# EAGLE design Main Board (EAGLE 8.6.3)
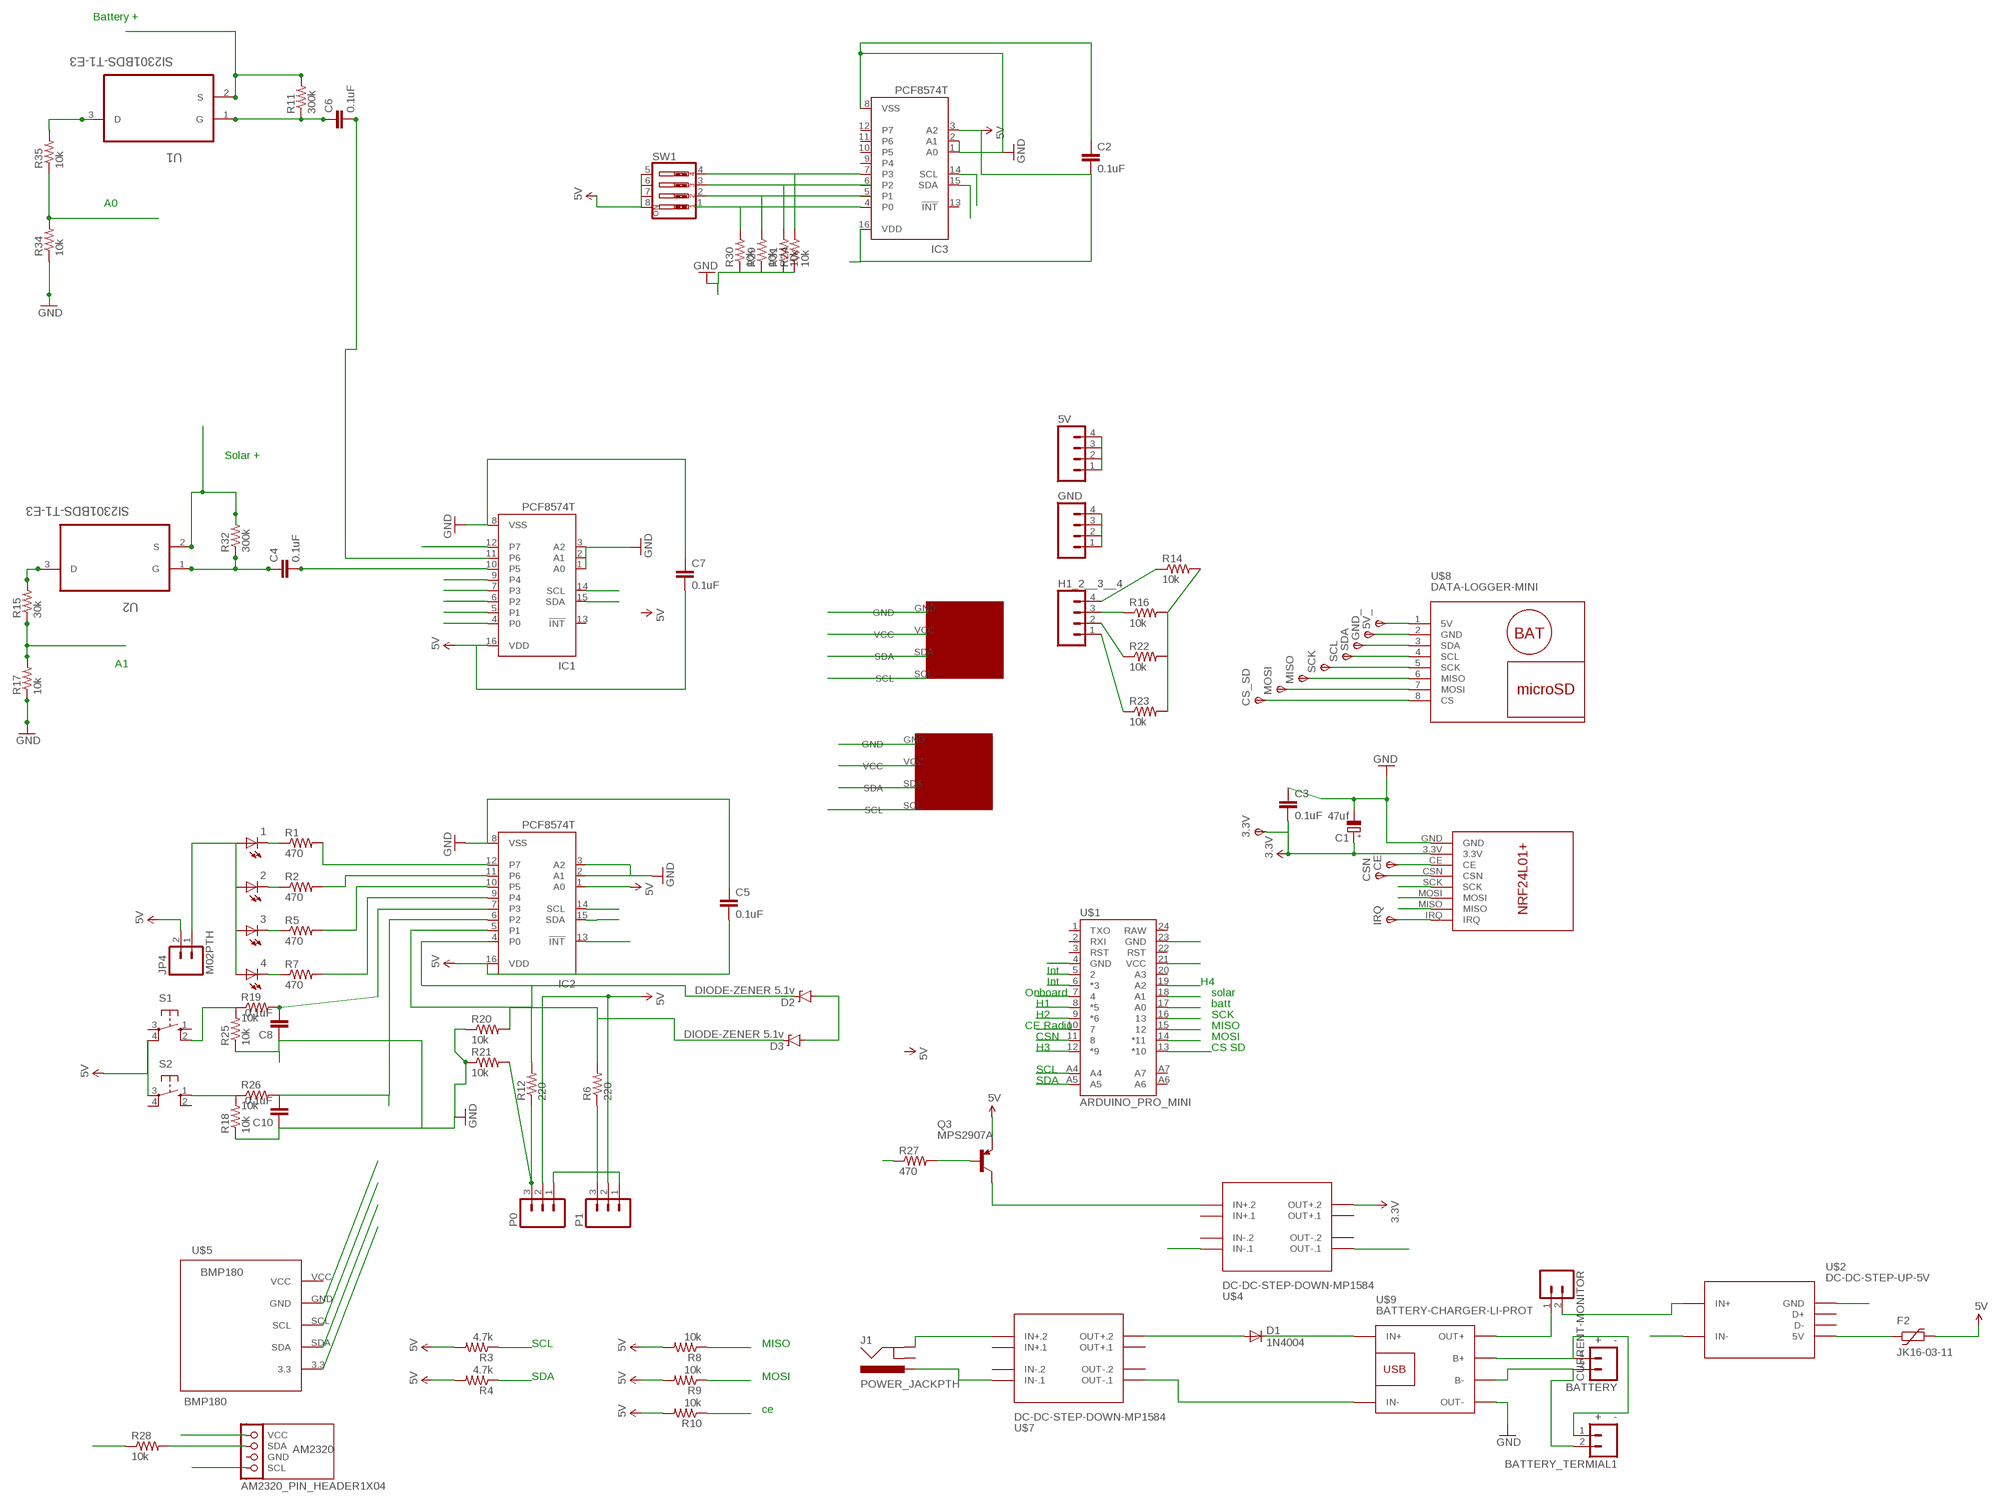
[diagram p0: schematic, sheet 1]

## Parts
1  LED3MM  [LED3MM]
2  LED3MM  [LED3MM]
3  LED3MM  [LED3MM]
3.3V  TPSB1,27  [B1,27]
4  LED3MM  [LED3MM]
5V  M04PTH  [1X04]
5V_  SCK  TPSB1,27  [B1,27]
AM2320  AM2320_PIN_HEADER1X04  [1X04]
BATTERY  + -  M02PTH  [1X02]
BATTERY_TERMIAL1  + -  M02PTH  [1X02]
C1  47uf  CPOL-EUE2.5-5  [E2,5-5]
C2  0.1uF  2.2UF-25V-+80/-20(0805)  [0805]
C3  0.1uF  2.2UF-25V-+80/-20(0805)  [0805]
C4  0.1uF  2.2UF-25V-+80/-20(0805)  [0805]
C5  0.1uF  2.2UF-25V-+80/-20(0805)  [0805]
C6  0.1uF  2.2UF-25V-+80/-20(0805)  [0805]
C7  0.1uF  2.2UF-25V-+80/-20(0805)  [0805]
C8  0.1uF  2.2UF-25V-+80/-20(0805)  [0805]
C10  0.1uF  2.2UF-25V-+80/-20(0805)  [0805]
CE  TPSB1,27  [B1,27]
CS_SD  TPSB1,27  [B1,27]
CSN  TPSB1,27  [B1,27]
CURRENT-MONITOR  M02PTH  [1X02]
D1  1N4004  [DO41-10]
D2  DIODE-ZENER 5.1v  DIODE-ZENERPTH  [DIODE-ZENER]
D3  DIODE-ZENER 5.1v  DIODE-ZENERPTH  [DIODE-ZENER]
F2  JK16-03-11  [JK16-03-11]
GND  M04PTH  [1X04]
GND_  GND  TPSB1,27  [B1,27]
H1_2__3__4  M04PTH  [1X04]
IC1  PCF8574T  [SO16W]
IC2  PCF8574T  [SO16W]
IC3  PCF8574T  [SO16W]
IRQ  TPSB1,27  [B1,27]
J1  POWER_JACKPTH  [POWER_JACK_PTH]
JP4  M02PTH  [1X02]
MISO  TPSB1,27  [B1,27]
MOSI  TPSB1,27  [B1,27]
P0  M03PTH  [1X03]
P1  M03PTH  [1X03]
Q3  MPS2907A  [TO92-CBE]
R1  470  RESISTOR1206  [1206]
R2  470  RESISTOR1206  [1206]
R3  4.7k  RESISTOR1206  [1206]
R4  4.7k  RESISTOR1206  [1206]
R5  470  RESISTOR1206  [1206]
R6  220  RESISTOR1206  [1206]
R7  470  RESISTOR1206  [1206]
R8  10k  RESISTOR1206  [1206]
R9  10k  RESISTOR1206  [1206]
R10  10k  RESISTOR1206  [1206]
R11  300k  RESISTORPTH-1/6W  [1/6W-RES]
R12  220  RESISTOR1206  [1206]
R14  10k  RESISTOR1206  [1206]
R15  30k  RESISTORPTH-1/6W  [1/6W-RES]
R16  10k  RESISTOR1206  [1206]
R17  10k  RESISTORPTH-1/6W  [1/6W-RES]
R18  10k  RESISTOR1206  [1206]
R19  10k  RESISTOR1206  [1206]
R20  10k  RESISTOR1206  [1206]
R21  10k  RESISTOR1206  [1206]
R22  10k  RESISTOR1206  [1206]
R23  10k  RESISTOR1206  [1206]
R24  10k  RESISTOR1206  [1206]
R25  10k  RESISTOR1206  [1206]
R26  10k  RESISTOR1206  [1206]
R27  470  RESISTOR1206  [1206]
R28  10k  RESISTOR1206  [1206]
R29  10k  RESISTOR1206  [1206]
R30  10k  RESISTOR1206  [1206]
R31  10k  RESISTOR1206  [1206]
R32  300k  RESISTORPTH-1/6W  [1/6W-RES]
R34  10k  RESISTORPTH-1/6W  [1/6W-RES]
R35  10k  RESISTORPTH-1/6W  [1/6W-RES]
S1  10-XX  [B3F-10XX]
S2  10-XX  [B3F-10XX]
SCK  SCK  TPSB1,27  [B1,27]
SCL  SCK  TPSB1,27  [B1,27]
SDA  SCK  TPSB1,27  [B1,27]
SW1  SW_DIP-4  [EDG-04]
U1  SI2301BDS-T1-E3  [SOT95P237X112-3N]
U2  SI2301BDS-T1-E3  [SOT95P237X112-3N]
U$1  ARDUINO_PRO_MINI  [ARDUINO_PRO_MINI]
U$2  DC-DC-STEP-UP-5V  [DC-DC-STEP-UP-5V]
U$3  NRF24L01  [NRF24L01]
U$4  DC-DC-STEP-DOWN-MP1584  [DC-DC-STEP-DOWN-MP1584]
U$5  BMP180  BMP180BMP180  [1X05]
U$7  DC-DC-STEP-DOWN-MP1584  [DC-DC-STEP-DOWN-MP1584]
U$8  DATA-LOGGER-MINI  [DATA-LOGGER-MINI]
U$9  BATTERY-CHARGER-LI-PROT  [BATTERY-CHARGER-LI-PROT]
U$10  TJC8-4P  [TJC8-4P]
U$11  TJC8-4P  [TJC8-4P]

## Nets
3.3V: 3.3V.TP(PP) C1.+ C3.2 U$3.3.3V U$4.OUT+.2 U$5.3.3
5V: 5V.1 5V.2 5V.3 5V.4 5V_.TP(PP) AM2320.1(VCC) C2.2 C5.2 C7.2 F2.P$2 IC1.16(VDD) IC2.1(A0) IC2.16(VDD) IC3.3(A2) IC3.16(VDD) JP4.2 P0.2 P1.2 Q3.E R3.2 R4.2 R8.2 R9.2 R10.2 R14.2 R16.2 R22.2 R23.2 R28.1 S1.4(P1) S2.3(P) SW1.5 SW1.6 SW1.7 SW1.8 U$1.21(VCC) U$8.1(5V) U$10.VCC U$11.VCC
12B: IC1.12(P7) R27.1
12B2: Q3.B R27.2
A0: R34.2 R35.1 U$1.17(A0)
A1: R15.1 R17.2 U$1.18(A1)
B+: BATTERY.1 BATTERY_TERMIAL1.1 R11.2 U1.2(S) U$9.B+
CE_RADIO: CE.TP(PP) R10.1 U$1.10 U$3.CE
CS-SD: CS_SD.TP(PP) U$1.13(*10) U$8.8(CS)
CSN: U$1.11
GND: AM2320.4(SCL) C1.- C2.1 C3.1 C5.1 C7.1 C8.1 C10.1 D2.P$2(A) D3.P$2(A) GND.1 GND.2 GND.3 GND.4 GND_.TP(PP) IC1.1(A0) IC1.2(A1) IC1.3(A2) IC1.8(VSS) IC2.2(A1) IC2.3(A2) IC2.8(VSS) IC3.1(A0) IC3.2(A1) IC3.8(VSS) P0.1 P1.1 R17.1 R18.1 R20.1 R21.1 R24.1 R25.1 R29.1 R30.1 R31.1 R34.1 U$1.4(GND) U$1.23(GND) U$2.GND U$2.IN- U$3.GND U$4.IN-.1 U$4.OUT-.1 U$5.GND U$8.2(GND) U$9.OUT- U$10.GND U$11.GND
H1: H1_2__3__4.1 IC1.5(P1) R23.1 U$1.8(*5)
H2: H1_2__3__4.2 IC1.6(P2) R22.1 U$1.9(*6)
H3: H1_2__3__4.3 IC1.7(P3) R16.1 U$1.12(*9)
H4: H1_2__3__4.4 IC1.9(P4) R14.1 U$1.19(A2)
INT8574: IC2.13(!INT) U$1.6(*3)
IRQ: IRQ.TP(PP) U$1.5 U$3.IRQ
MISO: MISO.TP(PP) R8.1 U$1.15 U$3.MISO U$8.6(MISO)
MOSI: MOSI.TP(PP) R9.1 U$1.14(*11) U$3.MOSI U$8.7(MOSI)
N$1: BATTERY.2 BATTERY_TERMIAL1.2 U$9.B-
N$2: C6.2 IC1.11(P6)
N$3: 4.K(C) R7.1
N$4: 3.K(C) R5.1
N$5: 2.K(C) R2.1
N$6: 1.K(C) R1.1
N$7: IC2.12(P7) R1.2
N$8: 1.A 2.A 3.A 4.A JP4.1
N$9: IC2.11(P6) R2.2
N$10: IC2.10(P5) R5.2
N$11: IC2.9(P4) R7.2
N$12: CURRENT-MONITOR.1 U$9.OUT+
N$13: D2.P$1(C) IC2.4(P0) IC2.5(P1) R12.2
N$14: U$7.OUT-.1 U$9.IN-
N$15: D1.C U$9.IN+
N$16: D1.A U$7.OUT+.2
N$17: F2.P$1 U$2.5V
N$18: CURRENT-MONITOR.2 U$2.IN+
N$19: J1.PWR U$7.IN-.1
N$20: C8.2 IC2.7(P3) R19.2
N$21: C4.2 IC1.10(P5)
N$22: P0.3 R12.1 R21.2
N$23: C10.2 IC2.6(P2) R26.2
N$24: P1.3 R6.1
N$25: C4.1 R32.1 U2.1(G)
N$26: IC3.4(P0) R30.2
N$27: D3.P$1(C) R6.2 R20.2
N$28: R15.2 U2.3(D)
N$29: C6.1 R11.1 U1.1(G)
N$30: R19.1 R25.2 S1.2(S1)
N$31: Q3.C U$4.IN+.2
N$32: R29.2 SW1.2
N$33: R31.2 SW1.3
N$34: IC3.7(P3) R24.2 SW1.4
N$35: R35.2 U1.3(D)
N$36: CSN.TP(PP) U$3.CSN
N$37: R18.2 R26.1 S2.1(S)
ONBOARD: AM2320.2(SDA) IC1.4(P0) R28.2 U$1.7
S+: J1.GND R32.2 U2.2(S) U$7.IN+.2
SCK: SCK.TP(PP) U$1.16 U$3.SCK U$8.5(SCK)
SCL: IC1.14(SCL) IC2.14(SCL) IC3.14(SCL) R3.1 SCL.TP(PP) U$1.A5 U$5.SCL U$8.4(SCL) U$10.SCL U$11.SCL
SDA: IC1.15(SDA) IC2.15(SDA) IC3.15(SDA) R4.1 SDA.TP(PP) U$1.A4 U$5.SDA U$8.3(SDA) U$10.SDA U$11.SDA
Unconnected: AM2320.3(GND) IC1.13(!INT) IC3.5(P1) IC3.6(P2) IC3.9(P4) IC3.10(P5) IC3.11(P6) IC3.12(P7) IC3.13(!INT) J1.GNDBREAK S1.1(S) S1.3(P) S2.2(S1) S2.4(P1) SW1.1 U$1.1(TXO) U$1.2(RXI) U$1.3(RST) U$1.20(A3) U$1.22(RST) U$1.24(RAW) U$1.A6 U$1.A7 U$2.D+ U$2.D- U$4.IN+.1 U$4.IN-.2 U$4.OUT+.1 U$4.OUT-.2 U$5.VCC U$7.IN+.1 U$7.IN-.2 U$7.OUT+.1 U$7.OUT-.2

## Notes on the sheet
- Battery +
- A0
- Solar +
- A1
- Int
- Int | H4
- Onboard | solar
- H1 | batt
- H2 | SCK
- CE Radio | MISO
- CSN | MOSI
- H3 | CS SD
- SCL
- SDA
- SCL | MISO
- SDA | MOSI
- ce

## Library data of the parts
1-4 = adafruit:LED: LED OSRAM: - CHIPLED LG R971, LG N971, LY N971, LG Q971, LY Q971, LO R971, LY R971 LH N974, LH R974 LS Q976, LO Q976, LY Q976 LO Q996 - Hyper CHIPLED LW Q18S LB Q993, LB Q99A, LB R99A - SideLED LS A670, LO A670, LY A670, LG A670, LP A670 LB A673, LV A673, LT A673, LW A673 LH A674 LY A675 LS A676, LA A676, LO A676, LY A676, LW A676 LS A679, LY A679, LG A679 - Hyper Micro SIDELED® LS Y876, LA Y876, LO Y876, LY Y876 LT Y87S - SmartLED LW L88C, LW L88S LB L89C, LB L89S, LG L890 LS L89K, LO L89K, LY L89K LS L896, LA L896, LO L896, LY L896 - TOPLED LS T670, LO T670, LY T670, LG T670, LP T670 LSG T670, LSP T670, LSY T670, LOP T670, LYG T670 LG T671, LOG T671, LSG T671 LB T673, LV T673, LT T673, LW T673 LH T674 LS T676, LA T676, LO T676, LY T676, LB T676, LH T676, LSB T676, LW T676 LB T67C, LV T67C, LT T67C, LS T67K, LO T67K, LY T67K, LW E67C LS E67B, LA E67B, LO E67B, LY E67B, LB E67C, LV E67C, LT E67C LW T67C LS T679, LY T679, LG T679 LS T770, LO T770, LY T770, LG T770, LP T770 LB T773, LV T773, LT T773, LW T773 LH T774 LS E675, LA E675, LY E675, LS T675 LS T776, LA T776, LO T776, LY T776, LB T776 LHGB T686 LT T68C, LB T68C - Hyper Mini TOPLED® LB M676 - Mini TOPLED Santana® LG M470 LS M47K, LO M47K, LY M47K Source: http://www.osram.convergy.de/
3.3V 5V_ CE CS_SD CSN GND_ IRQ MISO MOSI SCK SCL SDA = testpad:TPS: TEST PIN
5V GND H1_2__3__4 = SparkFun-Connectors:M04: Header 4 Standard 4-pin 0.1" header. Use with straight break away headers (SKU : PRT-00116), right angle break away headers (PRT-00553), swiss pins (PRT-00743), machine pins (PRT-00117), and female headers (PRT-00115). Molex polarized connector foot print use with SKU : PRT-08231 with associated crimp pins and housings. 1MM SMD Version SKU: PRT-10208
AM2320 = diy-drohne200-2:AM2320_PIN_HEADER: AM2320B Connector AM2320 pin assignment i2C or 1-Wir Pin Name Description 1 VDD Power supply(3.1-5.5V) 2 SDA Serial data, bidirectional port (1 Wire - connect SCL GND) 3 GND Ground 4 SCL Serial clock input port (single bus ground) Description <https://akizukidenshi.com/download/ds/aosong/AM2320.pdf>
BATTERY BATTERY_TERMIAL1 CURRENT-MONITOR JP4 = SparkFun-Connectors:M02: Standard 2-pin 0.1" header. Use with - straight break away headers ( PRT-00116) - right angle break away headers (PRT-00553) - swiss pins (PRT-00743) - machine pins (PRT-00117) - female headers (PRT-00115) Molex polarized connector foot print use with: PRT-08233 with associated crimp pins and housings. 2.54_SCREWTERM for use with PRT-10571. 3.5mm Screw Terminal footprints for PRT-08084 5mm Screw Terminal footprints for use with PRT-08432
C1 = rcl:CPOL-EU: POLARIZED CAPACITOR, European symbol
C2-C8 C10 = SparkFun-Capacitors:2.2UF-25V-+80/-20(0805): CAP-11624; PROD_ID: CAP-11624; VALUE: 2.2uF
D1 = adafruit:1N4004: DIODE General purpose 1N400x type rectifier (With bigger pads) http://www.ladyada.net/library/pcb/eaglelibrary.html
D2 D3 = SparkFun-DiscreteSemi:DIODE-ZENER: Zener Diode Production Part - 8199 3.4V Zener Voltage
F2 = ptc-littlefuse:JK16-03-11
IC1-IC3 = micro-philips:PCF8574: I2C-Bus Remote 8-bit I/O expander http://www.semiconductors.philips.com/acrobat_download/datasheets/PCF8574_4.pdf; MPN: PCF8574T/3,512; OC_FARNELL: 1201255; OC_NEWARK: 70R6870
J1 = SparkFun-Connectors:POWER_JACK: Power Jack This is the standard 5.5mm barrel jack for power. The PTH is the most common, proven, reliable, footprint. The Slot footprint only works if the mill layer is transmitted to the PCB fab house so be warned. Mating wall wart : TOL-00298 (and others); PROD_ID: PRT-00119
P0 P1 = SparkFun-Connectors:M03: Header 3 Standard 3-pin 0.1" header. Use with straight break away headers (SKU : PRT-00116), right angle break away headers (PRT-00553), swiss pins (PRT-00743), machine pins (PRT-00117), and female headers (PRT-00115). Molex polarized connector foot print use with SKU : PRT-08232 with associated crimp pins and housings.
Q3 = transistor-pnp:MPS2907*: PNP Transistror
R1-R10 R12 R14 R16 R18 R19 R22-R31 = SparkFun-Passives:RESISTOR: Resistor Basic schematic elements and footprints for 0603, 1206, and PTH resistors.
R11 R15 R17 R20 R21 R32 R34 R35 = SparkFun-Resistors:RESISTOR: Resistor Basic schematic elements and footprints for 0603, 1206, and PTH resistors.
S1 S2 = switch-omron:10-XX: OMRON SWITCH
SW1 = special:SW_DIP-4: DIP SWITCH
U1 U2 = Vishay_By_element14_Batch_1:SI2301BDS-T1-E3: MOSFET; MPN: SI2301BDS-T1-E3; OC_FARNELL: 1470099; OC_NEWARK: 06J7561; PACKAGE: SOT-23-3; SUPPLIER: VISHAY
U$1 = SparkFun-Boards:ARDUINO_PRO_MINI
U$2 = diy-modules:DC-DC-STEP-UP-5V: DC/DC Step-Up Converter
U$3 = eBay parts:NRF24L01: NRF24L01+ module from eBay NOTE: Untested layout
U$4 U$7 = diy-modules:DC-DC-STEP-DOWN-MP1584: DC/DC Step-Down Regulator based on MP1584 chip MP1584 datasheet available here: http://www.haoyuelectronics.com/Attachment/MP1584/MP1584.pdf Click here to find device on ebay.com <http://www.ebay.com/sch/mp1584+module>
U$5 = chris_Library:BMP180
U$8 = diy-modules:DATA-LOGGER-MINI: Mini Data Logger with microSD card and battery powered RTC based on DS1307 chip Arduino library for DS1307 and description are available here: https://www.pjrc.com/teensy/td_libs_DS1307RTC.html Tutorial how to use SD card with Arduino: https://www.arduino.cc/en/reference/SD Click here to find device on ebay.com <http://www.ebay.com/sch/mini+data+logger+arduino>
U$9 = diy-modules:BATTERY-CHARGER-LI-PROT: Lithium Battery 5V Charger with protection circuit More details available here: http://www.instructables.com/id/DIY-Lithium-ion-Battery-Charger/step4/TP4056-based-lithium-ion-battery-charger-module/ Click here to find device on ebay.com <http://www.ebay.com/sch/tp4056+charger+usb+protection>
U$10 U$11 = chris_Library:TJC8-4P

## Board
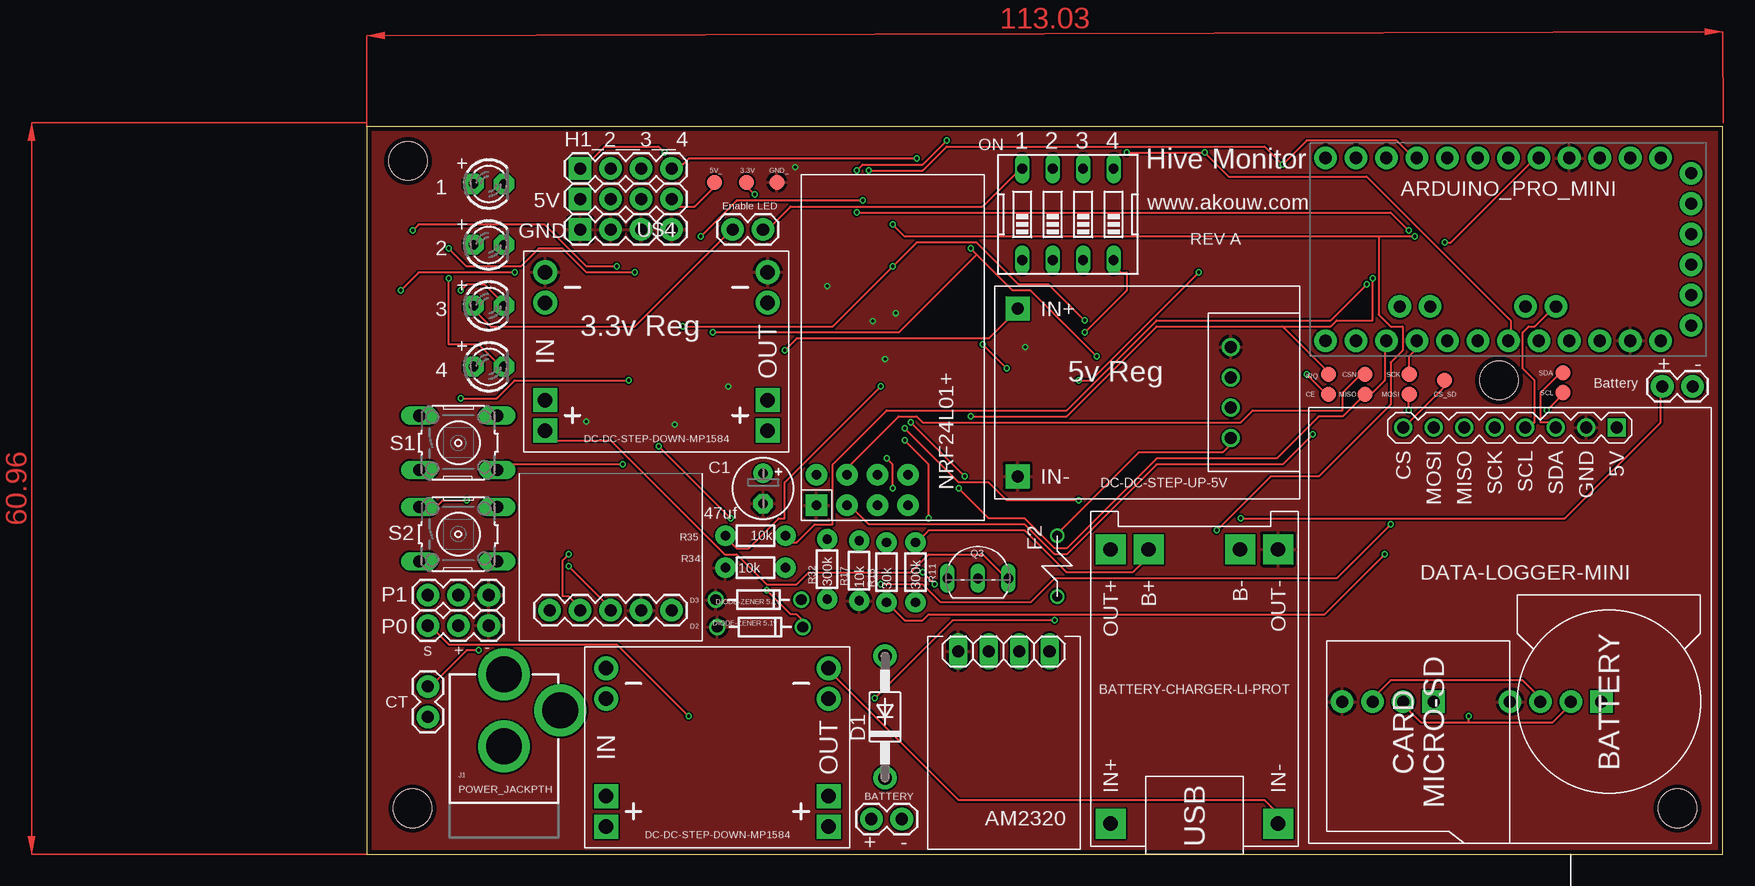
[diagram p1: board, top side]
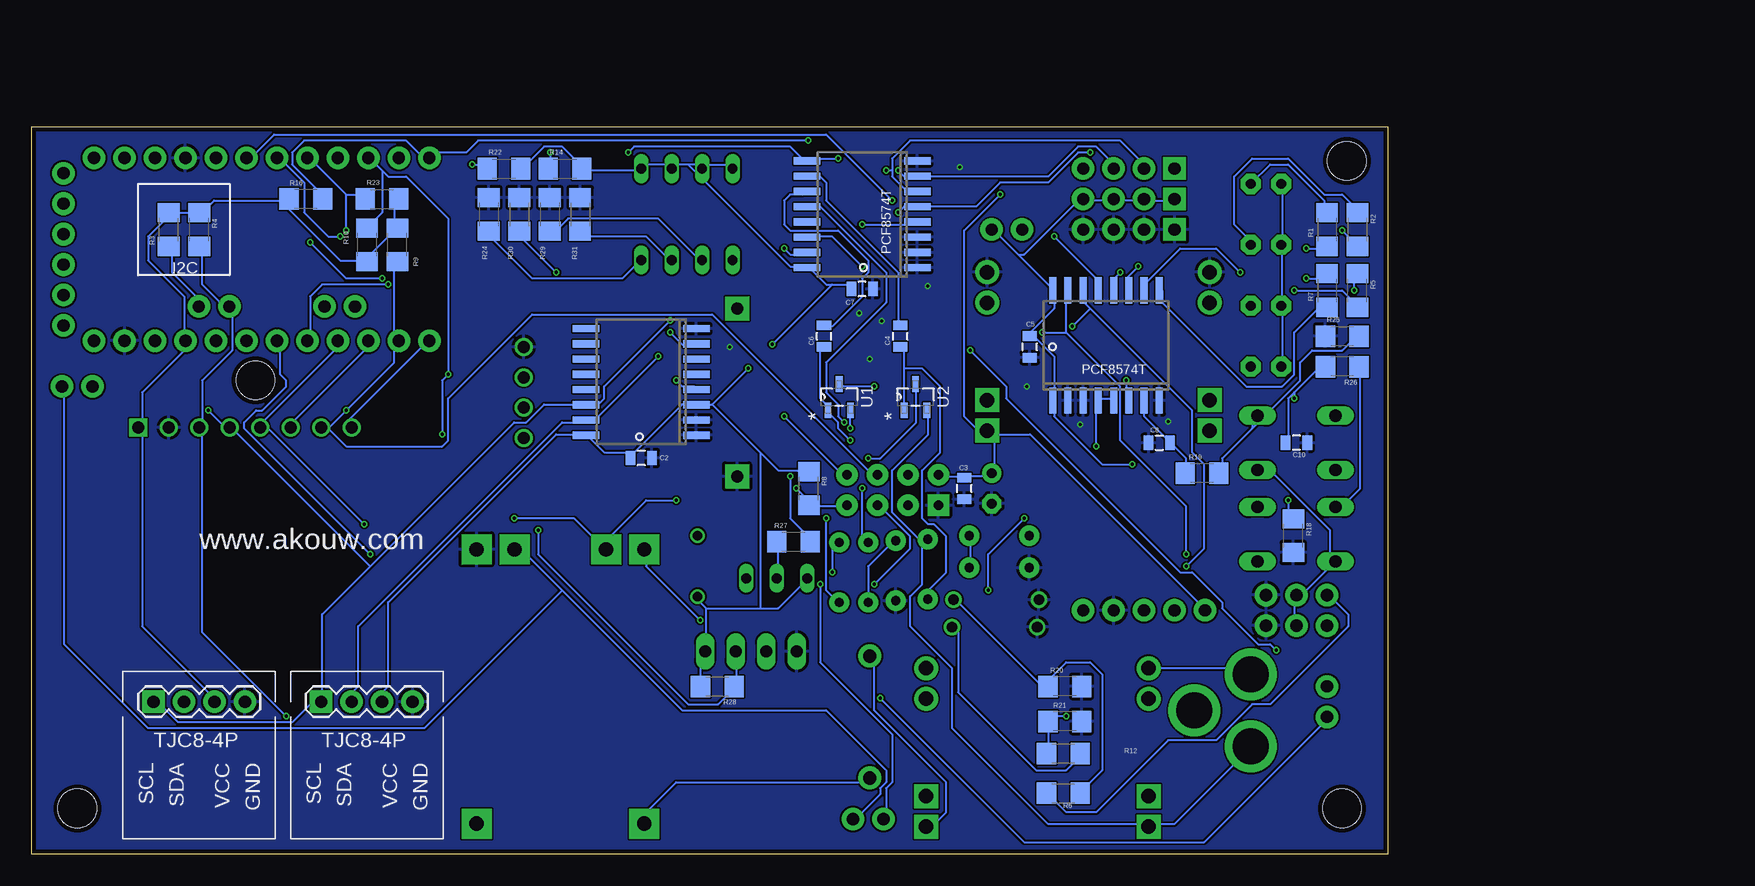
[diagram p2: board, bottom side, seen from below]

Size 113.01 x 60.63 mm. Coordinates in mm from the lower left corner, seen from the top.
Outline: 0,0 113.01,0 113.01,60.63 0,60.63 0,0
Copper layers (1*16): Top 0.035559375mm / dielectric 1.6mm / Bottom 0.035559375mm
Design rules "oshpark-2layer": minimum track width 6mil, minimum drill 10mil, track to track 6mil, track to pad 6mil, pad to pad 6mil, via to via 6mil, smd to smd 6mil, copper to edge 15mil, drill to drill 6mil, minimum pad ring 5mil, minimum via ring 5mil, stop-mask expansion 2.5mil, vias tented up to drill 0mil, thermal gap 10mil
Holes 3.2 mm at 3.81,3.81 109.22,3.81 3.43,57.78 94.36,39.5

### Footprints (pad centres in the part's own frame; a part is rotated, then mirrored left to right if it is on the bottom)
LED3MM = drill 0.813 pad 1.676 octagon: A -1.27,0; K 1.27,0
B1,27 = smd 1.27 x 1.27: TP 0,0
1X04 = drill 1.016 pad 1.88 square: 1 0,0 | drill 1.016 pad 1.88: 2 2.54,0; 3 5.08,0; 4 7.62,0
1X04' = drill 1.016 long: 1 -3.81,0; 2 -1.27,0; 3 1.27,0; 4 3.81,0
1X02 = drill 1.016 pad 1.88: 1 0,0; 2 2.54,0
E2,5-5 = drill 0.813 pad 1.6: + -1.27,0 | drill 0.813 pad 1.6 octagon: - 1.27,0
0805 = smd 0.8 x 1.2: 1 -0.9,0; 2 0.9,0
DO41-10 = drill 1.118 pad 1.93: A 5.08,0; C -5.08,0
DIODE-ZENER = drill 0.9: P$1 -3.556,0; P$2 3.556,0
JK16-03-11 = drill 0.8: P$1 -2.54,0; P$2 2.54,0
SO16W = smd 0.6 x 2.2: 1 -4.445,-4.6; 2 -3.175,-4.6; 3 -1.905,-4.6; 4 -0.635,-4.6; 5 0.635,-4.6; 6 1.905,-4.6; 7 3.175,-4.6; 8 4.445,-4.6; 9 4.445,4.6; 10 3.175,4.6; 11 1.905,4.6; 12 0.635,4.6; 13 -0.635,4.6; 14 -1.905,4.6; 15 -3.175,4.6; 16 -4.445,4.6
POWER_JACK_PTH = drill 2.997 pad 4.318: GND 0,7.7; GNDBREAK 4.7,10.7; PWR 0,13.7
1X03 = drill 1.016 pad 1.88: 1 0,0; 2 2.54,0; 3 5.08,0
TO92-CBE = drill 0.813 long: B 0,0; C 2.54,0; E -2.54,0
1206 = smd 1.6 x 1.8: 1 -1.4,0; 2 1.4,0
1/6W-RES = drill 0.762 pad 1.676: 1 -2.5,0; 2 2.5,0
B3F-10XX = drill 1.016 long: 1 -3.251,2.261; 2 3.251,2.261; 3 -3.251,-2.261; 4 3.251,-2.261
EDG-04 = drill 0.813 long: 1 -3.81,-3.81; 2 -1.27,-3.81; 3 1.27,-3.81; 4 3.81,-3.81; 5 3.81,3.81; 6 1.27,3.81; 7 -1.27,3.81; 8 -3.81,3.81
SOT95P237X112-3N = smd 1.321 x 0.559: 1 -1.092,0.94; 2 -1.092,-0.94; 3 1.092,0
ARDUINO_PRO_MINI = drill 1.016 pad 1.88: 1 -7.62,12.7; 2 -7.62,10.16; 3 -7.62,7.62; 4 -7.62,5.08; 5 -7.62,2.54; 6 -7.62,0; 7 -7.62,-2.54; 8 -7.62,-5.08; 9 -7.62,-7.62; 10 -7.62,-10.16; 11 -7.62,-12.7; 12 -7.62,-15.24; 13 7.62,-15.24; 14 7.62,-12.7; 15 7.62,-10.16; 16 7.62,-7.62; 17 7.62,-5.08; 18 7.62,-2.54; 19 7.62,0; 20 7.62,2.54; 21 7.62,5.08; 22 7.62,7.62; 23 7.62,10.16; 24 7.62,12.7; A4 4.763,1.429; A5 4.763,3.969; A6 4.763,-9.049; A7 4.763,-6.509; BLK -6.35,15.24; GND -3.81,15.24; GRN 6.35,15.24; RXI 1.27,15.24; TXO 3.81,15.24; VCC -1.27,15.24
DC-DC-STEP-UP-5V = drill 1: 5V 6.985,-3.81; D+ 6.985,1.27; D- 6.985,-1.27; GND 6.985,3.81 | drill 1 pad 2 square: IN+ -10.795,6.985; IN- -10.795,-6.985
NRF24L01 = drill 0.8 pad 1.778: 3.3V 0,2.54; CE 2.54,0; CSN 2.54,2.54; IRQ 7.62,2.54; MISO 7.62,0; MOSI 5.08,2.54; SCK 5.08,0 | drill 0.8 pad 1.778 square: GND 0,0
DC-DC-STEP-DOWN-MP1584 = drill 1.2 pad 2 square: IN+.1 -9.271,-4.064; IN+.2 -9.271,-6.604; OUT+.1 9.271,-4.064; OUT+.2 9.271,-6.604 | drill 1.2 pad 2: IN-.1 -9.271,6.604; IN-.2 -9.271,4.064; OUT-.1 9.271,6.604; OUT-.2 9.271,4.064
1X05 = drill 1.016 pad 1.88: 3.3 10.16,0; GND 2.54,0; SCL 5.08,0; SDA 7.62,0; VCC 0,0
DATA-LOGGER-MINI = drill 1 square: 1 -16.51,8.89 | drill 1: 2 -16.51,6.35; 3 -16.51,3.81; 4 -16.51,1.27; 5 -16.51,-1.27; 6 -16.51,-3.81; 7 -16.51,-6.35; 8 -16.51,-8.89
BATTERY-CHARGER-LI-PROT = drill 1.2 pad 2.5 square: B+ 10.795,3.81; B- 10.795,-3.81; IN+ -12.065,6.985; IN- -12.065,-6.985; OUT+ 10.795,6.985; OUT- 10.795,-6.985
TJC8-4P = drill 1.016 pad 1.88: GND 7.62,0; SDA 2.54,0; VCC 5.08,0 | drill 1.016 pad 1.88 square: SCL 0,0

### Placement (x,y rotation side)
1  10.16,55.88 0 top
2  10.16,50.8 0 top
3  10.16,45.72 0 top
3.3V  31.62,56.01 0 top
4  10.16,40.64 0 top
5V  17.78,54.61 0 top
5V_  28.96,56.01 0 top
AM2320  AM2320_PIN_HEADER1X04  [1X04']  53.09,16.89 180 top
BATTERY  42.04,2.92 0 top
BATTERY_TERMIAL1  107.95,38.99 0 top
C1  33.02,30.48 270 top
C2  62.23,33.02 180 bottom
C3  35.31,30.48 90 bottom
C4  40.64,43.18 90 bottom
C5  29.84,42.29 90 bottom
C6  46.99,43.18 90 bottom
C7  43.82,47.12 180 bottom
C8  19.05,34.29 0 bottom
C10  7.62,34.29 180 bottom
CE  80.14,38.35 0 top
CS_SD  89.79,39.5 0 top
CSN  83.19,40.01 0 top
CURRENT-MONITOR  5.08,11.43 90 top
D1  43.18,11.43 90 top
D2  32.77,18.92 180 top
D3  32.64,21.21 180 top
F2  57.53,24 270 top
GND  17.78,52.07 0 top
GND_  34.16,56.01 0 top
H1_2__3__4  17.78,57.15 0 top
IC1  43.82,53.34 90 bottom
IC2  23.49,42.42 0 bottom
IC3  62.23,39.37 90 bottom
IRQ  80.14,40.01 0 top
J1  11.43,1.27 0 top
JP4  30.48,52.07 0 top
MISO  83.19,38.35 0 top
MOSI  86.87,38.35 0 top
P0  10.16,19.05 180 top
P1  10.16,21.59 180 top
Q3  50.93,22.99 0 top
R1  5.08,52.07 270 bottom
R2  2.54,52.07 270 bottom
R3  101.6,52.07 90 bottom
R4  99.06,52.07 90 bottom
R5  2.54,46.99 90 bottom
R6  27.05,5.08 0 bottom
R7  5.08,46.99 270 bottom
R8  48.26,30.48 90 bottom
R9  82.55,50.8 90 bottom
R10  85.09,50.8 270 bottom
R11  45.72,23.5 90 top
R12  27.05,8.38 0 bottom
R14  68.58,57.15 0 bottom
R15  43.31,23.5 90 top
R16  90.17,54.61 180 bottom
R17  41.02,23.62 90 top
R18  7.87,26.54 90 bottom
R19  15.49,31.75 180 bottom
R20  26.92,13.97 180 bottom
R21  26.92,11.05 180 bottom
R22  73.66,57.15 0 bottom
R23  83.82,54.61 0 bottom
R24  74.93,53.34 270 bottom
R25  3.81,43.18 0 bottom
R26  3.81,40.64 180 bottom
R27  49.53,26.04 180 bottom
R28  55.88,13.97 0 bottom
R29  69.85,53.34 270 bottom
R30  72.39,53.34 270 bottom
R31  67.31,53.34 270 bottom
R32  38.35,23.75 90 top
R34  32.38,23.88 0 top
R35  32.38,26.54 180 top
S1  7.62,34.29 0 top
S2  7.62,26.67 0 top
SCK  86.87,40.01 0 top
SCL  99.7,38.48 0 top
SDA  99.7,40.13 0 top
SW1  58.42,53.34 0 top
U1  45.72,38.1 90 bottom
U2  39.37,38.1 90 bottom
U$1  95.12,50.42 270 top
U$2  65.02,38.48 0 top
U$3  37.47,29.08 0 top
U$4  24.13,41.91 0 top
U$5  25.4,20.32 180 top
U$7  29.21,8.89 0 top
U$8  95.25,19.05 270 top
U$9  68.96,14.61 90 top
U$10  88.9,12.7 0 bottom
U$11  102.87,12.7 0 bottom

### Tracks (layer width: path | path; a pad name or v marks a point on that pad's centre or on a via)
3.3V  (via drill 0.25)
  Top 0.152: v32.31,55 31.81,55.5 31.81,56 3.3V.TP
  Bottom 0.152: U$3.3.3V 37.31,31.5 35.31,31.5 C3.2 34.81,31.5 33.31,31.5 C1.+ 32.81,32 32.81,35 | v32.31,55 35.31,52 35.31,36.5 33.81,35 U$4.OUT+.2 | 32.81,35 33.31,35 U$4.OUT+.2 | 32.81,35 29.81,35 15.31,20.5 U$5.3.3 | 32.81,35 U$4.OUT+.2
5V  (via drill 0.25)
  Top 0.152: U$10.VCC 84.31,13 84.31,13.5 85.31,14.5 96.31,14.5 97.81,13 U$11.VCC | 5V_.TP 28.81,56 28.81,55.5 27.31,54 25.81,54 25.31,54.5 5V.4 | v21.31,32.5 11.31,32.5 S1.4 | SW1.8 54.31,57 51.31,54 35.31,54 33.81,52.5 33.31,52.5 JP4.2 | v51.31,42.5 v53.31,40.5
  Bottom 0.152: R28.1 57.31,14 57.31,16.5 AM2320.1 56.81,17 56.81,20.5 | 56.81,20.5 57.31,21 F2.P$2 | 56.81,20.5 52.31,20.5 | 52.31,20.5 50.81,20.5 48.81,22.5 Q3.E | 56.31,37.5 52.31,33.5 | 52.31,33.5 50.81,32 48.31,32 R8.2 | 56.31,37.5 57.31,37.5 IC3.3 57.81,37.5 58.81,37.5 62.81,33.5 C2.2 63.31,33.5 65.31,33.5 66.81,35 IC3.16 67.31,35 69.31,35 83.31,21 83.31,14 84.31,13 U$10.VCC | 52.31,33.5 52.31,20.5 | R23.2 82.81,54.5 82.81,52.5 R9.2 82.81,52 84.81,50 84.81,49.5 R10.2 85.31,49.5 87.31,49.5 92.31,54.5 | 92.31,54.5 97.81,54.5 98.81,53.5 R4.2 99.31,53.5 101.31,53.5 R3.2 101.81,53 103.31,51.5 103.31,49.5 100.31,46.5 100.31,43 U$1.21 99.81,42.5 103.81,38.5 103.81,36 U$8.1 103.81,35.5 103.81,19 97.81,13 U$11.VCC | 92.31,54.5 91.81,54.5 R16.2 92.31,54.5 | R22.2 71.81,57.5 70.31,59 68.81,59 67.31,57.5 R14.2 66.81,57 62.31,57 SW1.5 61.81,57.5 59.81,57.5 SW1.6 59.31,57.5 58.31,57.5 | 46.31,47.5 46.81,47.5 48.31,49 IC1.16 48.81,49 49.81,49 58.31,57.5 | 46.31,47.5 44.81,47.5 C7.2 | SW1.8 54.81,57.5 56.81,57.5 SW1.7 57.31,57.5 58.31,57.5 | S1.4 10.81,32 9.81,32 4.81,27 4.81,24.5 S2.3 4.81,24 7.31,21.5 P1.2 7.81,21.5 7.81,19.5 P0.2 | 5V.1 17.81,54.5 20.31,54.5 5V.2 20.81,54.5 22.81,54.5 5V.3 23.31,54.5 25.31,54.5 5V.4 25.81,54.5 30.31,50 30.81,50 | 29.81,43.5 27.81,45.5 27.81,47 | 29.81,43.5 27.81,41.5 27.81,38 IC2.1 27.81,37.5 27.81,36.5 23.81,32.5 v21.31,32.5 | 29.81,43.5 C5.2 | 27.81,47 30.81,50 | 30.81,50 32.81,52 JP4.2 | 27.81,47 IC2.16 | v53.31,40.5 56.31,37.5 | 46.31,47.5 v51.31,42.5
12B  (via drill 0.25)
  Top 0.152: v45.31,36 v49.81,31.5
  Bottom 0.152: v49.81,31.5 49.81,28 48.31,26.5 R27.1 | v45.31,36 45.81,36.5 45.81,37.5 46.81,38.5 46.81,41 41.81,46 41.81,48.5 47.31,54 48.31,54 IC1.12
12B2
  Bottom 0.152: R27.2 50.81,26 50.81,23 Q3.B
A0  (via drill 0.25)
  Top 0.152: v83.31,47.5 80.31,44.5 65.81,44.5 58.31,37 43.31,37 38.81,32.5 38.81,27.5 37.31,27.5 35.81,26 35.31,26 34.81,26.5 R35.1
  Bottom 0.152: R34.2 34.81,24 34.81,26.5 R35.1 | v83.31,47.5 88.81,47.5 89.81,46.5 89.81,43 U$1.17
A1  (via drill 0.25)
  Top 0.152: v84.81,25 79.81,20 46.81,20 46.31,19.5 44.81,19.5 43.81,20.5 43.31,20.5 R15.1
  Bottom 0.152: R15.1 43.31,24 41.31,26 R17.2 | v84.81,25 95.31,35.5 95.31,36 94.31,37 93.81,37 91.81,39 91.81,39.5 92.31,40 92.31,42.5 U$1.18
B+  (via drill 0.25)
  Top 0.152: v44.81,35.5 49.31,31 51.81,31 53.31,29.5 v59.31,29.5 | R11.2 45.81,26 46.81,27 54.81,27 58.31,23.5 63.81,23.5 65.31,25 U$9.B+ | v46.31,23.5 v47.31,22.5 | v72.81,28 99.81,28 107.81,36 107.81,38.5 BATTERY_TERMIAL1.1
  Bottom 0.152: v44.81,35.5 44.81,37 U1.2 | v59.31,29.5 61.81,29.5 64.81,26.5 64.81,25.5 U$9.B+ 65.31,25.5 67.81,28 v72.81,28 | v47.31,22.5 47.31,16 41.31,10 41.31,6 41.81,5.5 41.81,3 BATTERY.1 | v46.31,23.5 46.31,25.5 45.81,26 R11.2
CE_RADIO  (via drill 0.25)
  Top 0.152: v78.31,40 79.81,38.5 CE.TP | v78.81,35 76.31,32.5 65.81,32.5 58.31,25 57.31,25 54.81,27.5 41.81,27.5 40.31,29 U$3.CE
  Bottom 0.152: 83.81,57 84.81,58 U$1.10 | 83.81,57 83.31,56.5 81.81,56.5 78.31,53 v78.31,40 78.81,39.5 v78.81,35 | 83.81,57 83.81,53.5 84.81,52.5 R10.1
CS-SD
  Top 0.152: CS_SD.TP 89.81,39 86.81,36 U$8.8
  Bottom 0.152: U$1.13 80.31,42.5 86.81,36 U$8.8
GND  (via drill 0.25)
  other vias: 54.86,42.29 38.35,47.37 42.16,44.45 43.18,41.27 44.07,45.09 35.69,57.28 30.1,38.99 25.65,35.81 18.29,36.07
  pour Bottom: -10.16,86.36 123.19,86.36 123.19,-10.16 -10.16,-10.16
  pour Top: -7.62,83.82 124.46,83.82 124.46,-7.62 -7.62,-10.16
  pour Top: -7.62,77.47 125.73,83.82 125.73,-7.62 -7.62,-16.51
H1  (via drill 0.25)
  Top 0.152: v24.81,58.5 24.31,59 19.81,59 18.31,57.5 17.81,57.5 H1_2__3__4.1 | v86.81,52 85.31,53.5 v40.81,53.5
  Bottom 0.152: 86.81,55 85.31,55 R23.1 | 86.81,55 89.81,58 U$1.8 | v24.81,58.5 25.81,58.5 28.31,56 32.31,56 34.31,54 38.81,54 IC1.5 39.31,54 40.31,54 v40.81,53.5 | v86.81,52 86.81,55
H2  (via drill 0.25)
  Top 0.152: U$1.9 87.31,58.5 86.81,58.5 85.81,59.5 78.31,59.5 v76.31,57.5 74.81,59 48.31,59 46.31,57 v41.81,57
  Bottom 0.152: v76.31,57.5 75.31,57.5 R22.1 | 41.31,57 41.31,58 39.81,59.5 22.31,59.5 20.31,57.5 H1_2__3__4.2 | 41.31,57 41.31,56.5 40.31,55.5 39.31,55.5 IC1.6 | 41.31,57 v41.81,57
H3  (via drill 0.25)
  Top 0.152: v48.31,59.5 46.31,57.5 41.31,57.5 v40.81,57
  Bottom 0.152: R16.1 88.81,55 91.31,57.5 91.31,58.5 90.31,59.5 81.81,59.5 80.31,58 U$1.12 79.81,58.5 76.81,58.5 75.81,59.5 v48.31,59.5 | H1_2__3__4.3 22.81,57.5 24.31,59 25.81,59 28.31,56.5 38.81,56.5 IC1.7 39.31,56.5 40.31,56.5 v40.81,57
H4  (via drill 0.25)
  Top 0.152: v63.31,58.5 v69.81,58.5 71.81,56.5 83.31,56.5 95.31,44.5 95.31,43 U$1.19 | v45.81,58 26.81,58 26.31,57.5 25.81,57.5 H1_2__3__4.4
  Bottom 0.152: v69.81,58.5 69.81,57.5 R14.1 | v63.31,58.5 62.81,59 49.81,59 48.81,58 IC1.9 48.31,58 v45.81,58
INT8574  (via drill 0.25)
  Top 0.152: v27.81,51.5 30.81,54.5 v41.31,54.5
  Bottom 0.152: v27.81,51.5 24.31,48 24.31,47.5 IC2.13 | v41.31,54.5 46.81,60 92.81,60 94.81,58 U$1.6
IRQ  (via drill 0.25)
  Top 0.152: 76.31,44 79.81,40.5 IRQ.TP | 76.31,44 65.81,44 58.31,36.5 v50.31,36.5 | v89.81,51 90.31,51 97.31,58 U$1.5 | v83.81,48 83.81,44.5 80.81,44.5 80.31,44 76.31,44
  Bottom 0.152: v50.31,36.5 45.31,31.5 U$3.IRQ | v89.81,51 86.81,48 v83.81,48
MISO  (via drill 0.25)
  Top 0.152: U$1.15 84.81,42.5 84.81,39.5 83.81,38.5 83.31,38.5 MISO.TP 82.81,38 81.31,36.5 79.31,36.5 75.81,33 65.81,33 58.31,25.5 57.31,25.5 54.81,28 51.81,28 v49.31,30.5
  Bottom 0.152: U$3.MISO 45.31,29 47.81,29 R8.1 48.31,29.5 v49.31,30.5 | U$8.6 91.31,36 84.81,42.5 U$1.15
MOSI  (via drill 0.25)
  Top 0.152: v86.81,37 86.81,38 MOSI.TP
  Bottom 0.152: R9.1 82.81,49 82.81,43 U$1.14 82.81,42.5 82.81,41 v86.81,37 88.31,35.5 | 88.31,35.5 88.81,35.5 U$8.7 88.31,35.5 | 88.31,35.5 86.81,34 78.81,34 78.31,34.5 78.31,38 71.31,45 56.31,45 43.31,32 42.81,32 U$3.MOSI
N$1
  Bottom 0.152: 68.81,22 72.31,25.5 U$9.B- | 68.81,22 58.81,12 46.81,12 41.81,7 41.81,6 42.31,5.5 42.31,5 44.31,3 BATTERY.2 | 68.81,22 80.31,10.5 103.31,10.5 110.31,17.5 110.31,38.5 BATTERY_TERMIAL1.2
N$2
  Bottom 0.152: C6.2 46.81,44 46.31,44 43.81,46.5 43.81,48 43.31,48.5 43.31,49.5 45.81,52 49.81,52 50.31,52.5 50.31,54.5 49.81,55 48.81,55 IC1.11
N$3  (via drill 0.25)
  Top 0.152: v6.81,48 6.81,42.5 9.31,42.5 10.81,41 11.31,41 4.K
  Bottom 0.152: v6.81,48 5.31,48 R7.1
N$4  (via drill 0.25)
  Top 0.152: v7.81,47 8.31,47.5 9.81,47.5 11.31,46 3.K
  Bottom 0.152: v7.81,47 3.81,47 2.81,46 R5.1
N$5
  Bottom 0.152: R2.1 2.81,53.5 2.81,54 3.81,55 5.31,55 8.31,58 11.31,58 12.81,56.5 12.81,52.5 11.31,51 2.K
N$6
  Bottom 0.152: 1.K 9.81,57.5 8.31,57.5 5.31,54.5 5.31,53.5 R1.1
N$7  (via drill 0.25)
  Top 0.152: v6.81,50.5 8.31,49 12.81,49 14.31,50.5 16.31,50.5 18.31,48.5 v22.31,48.5
  Bottom 0.152: v6.81,50.5 5.31,50.5 R1.2 | v22.31,48.5 22.81,48 22.81,47.5 IC2.12
N$8
  Top 0.152: JP4.1 30.31,52 22.31,44 10.31,44 8.81,45.5 3.A
  Bottom 0.152: 1.A 8.81,55.5 8.81,51 2.A 8.81,50.5 8.81,46 3.A 8.81,45.5 8.81,41 4.A
N$9  (via drill 0.25)
  Top 0.152: v3.81,52 4.31,52.5 14.81,52.5 18.31,49 v20.81,49
  Bottom 0.152: v3.81,52 2.81,51 R2.2 | v20.81,49 21.81,48 21.81,47.5 IC2.11
N$10  (via drill 0.25)
  Top 0.152: v2.81,47 4.31,48.5 v12.31,48.5
  Bottom 0.152: v2.81,47 2.81,48 R5.2 | v12.31,48.5 14.31,50.5 17.31,50.5 20.31,47.5 IC2.10
N$11
  Bottom 0.152: R7.2 5.31,45.5 5.81,45.5 7.81,43.5 7.81,40 8.81,39 11.81,39 18.81,46 18.81,47 IC2.9
N$12  (via drill 0.25)
  Top 0.152: v42.31,13 48.81,19.5 v57.31,19.5
  Bottom 0.152: v42.31,13 30.31,1 15.31,1 5.31,11 CURRENT-MONITOR.1 | v57.31,19.5 61.81,24 61.81,25 U$9.OUT+
N$13  (via drill 0.25)
  Top 0.152: v30.31,28 v24.31,34 | v33.31,22 35.31,20 35.81,20 36.81,19 D2.P$1
  Bottom 0.152: IC2.5 22.81,38 24.31,38 IC2.4 24.31,37.5 v24.31,34 | R12.2 25.81,8 26.81,7 29.31,7 35.81,13.5 35.81,18.5 36.31,19 D2.P$1 | v30.31,28 33.31,25 v33.31,22
N$14
  Top 0.152: U$7.OUT-.1 38.81,15 49.31,4.5 74.81,4.5 76.31,3 U$9.IN-
N$15
  Bottom 0.152: D1.C 43.31,6 59.31,6 62.31,3 U$9.IN+
N$16
  Bottom 0.152: D1.A 42.81,16.5 42.81,12 36.81,6 36.81,3.5 38.31,2 U$7.OUT+.2
N$17
  Top 0.152: F2.P$1 57.81,27 64.31,33.5 71.31,33.5 72.31,34.5 U$2.5V
N$18  (via drill 0.25)
  Top 0.152: v9.31,17 8.31,17 5.31,14 CURRENT-MONITOR.2 | v34.81,42 35.81,43 51.81,43 53.81,45 U$2.IN+
  Bottom 0.152: v9.31,17 9.81,17.5 10.81,17.5 13.81,20.5 13.81,21 16.31,23.5 17.31,23.5 31.81,38 31.81,39 v34.81,42
N$19
  Bottom 0.152: U$7.IN-.1 19.81,15.5 12.31,15.5 11.81,15 J1.PWR
N$20
  Bottom 0.152: R19.2 16.81,32 16.81,33 17.81,34 C8.2 18.31,34.5 20.31,36.5 20.31,37.5 IC2.7
N$21
  Bottom 0.152: C4.2 40.81,44 40.81,48.5 46.81,54.5 46.81,56 47.31,56.5 48.31,56.5 IC1.10
N$22  (via drill 0.25)
  Top 0.152: v26.81,11.5 20.81,17.5 6.81,17.5 5.81,18.5 5.81,19 5.31,19 P0.3
  Bottom 0.152: R12.1 28.31,8.5 28.31,11 R21.2 28.31,11.5 v26.81,11.5
N$23  (via drill 0.25)
  Top 0.152: v21.81,39.5 12.31,39.5 10.81,38 v7.81,38
  Bottom 0.152: 7.81,38.5 5.31,41 R26.2 | 7.81,38.5 8.31,38 8.31,34.5 C10.2 | v21.81,39.5 21.81,38 IC2.6 | 7.81,38.5 v7.81,38
N$24
  Bottom 0.152: R6.1 28.31,5 26.81,3.5 24.31,3.5 18.31,9.5 14.31,9.5 11.31,12.5 9.81,12.5 3.31,19 3.31,20 4.81,21.5 P1.3
N$25
  Bottom 0.152: 40.31,40.5 40.31,37.5 U2.1 | 40.31,40.5 40.31,42 C4.1 | 40.31,40.5 38.81,40.5 37.31,39 37.31,33.5 38.81,32 38.81,28 38.31,27.5 37.81,27.5 36.81,26.5 36.81,23.5 38.81,21.5 R32.1
N$26  (via drill 0.25)
  Top 0.152: v69.31,48.5 60.31,39.5 v59.31,39.5
  Bottom 0.152: v69.31,48.5 72.31,51.5 R30.2 | v59.31,39.5 58.81,39 57.81,39 IC3.4
N$27
  Bottom 0.152: 28.81,14 26.81,16 24.81,16 23.81,15 23.81,7 25.31,5.5 R6.2 | 28.81,14 35.81,21 D3.P$1 | 28.81,14 R20.2
N$28  (via drill 0.25)
  Top 0.152: v43.31,33 43.81,32.5 v43.81,30.5
  Bottom 0.152: v43.31,33 42.31,33 39.31,36 39.31,39 U2.3 | v43.81,30.5 43.81,26.5 R15.2
N$29  (via drill 0.25)
  Top 0.152: v44.81,34.5 46.81,32.5 v46.81,28
  Bottom 0.152: C6.1 47.31,42 47.31,38 46.81,37.5 U1.1 46.81,37 45.81,36 45.81,35.5 v44.81,34.5 | v46.81,28 46.81,22 45.81,21 R11.1
N$30
  Bottom 0.152: 11.31,35.5 13.81,33 13.81,32 R19.1 | 11.31,35.5 11.31,36.5 S1.2 | 11.31,35.5 7.31,39.5 7.31,41 6.31,42 3.81,42 2.81,43 R25.2
N$31
  Top 0.152: Q3.C 53.31,23 51.31,25 46.81,25 45.31,23.5 36.81,23.5 35.81,22.5 33.31,22.5 30.81,25 29.81,25 20.31,34.5 15.31,34.5 14.81,35 U$4.IN+.2
N$32
  Bottom 0.152: R29.2 69.81,52 69.31,52 68.31,53 60.81,53 57.31,49.5 SW1.2
N$33
  Bottom 0.152: R31.2 67.31,51.5 61.81,51.5 59.81,49.5 SW1.3
N$34  (via drill 0.25)
  Top 0.152: v59.81,43.5 63.31,47 63.31,48.5 62.81,48.5 61.81,49.5 SW1.4
  Bottom 0.152: R24.2 74.81,51.5 71.31,48 63.81,48 62.31,49.5 SW1.4 | v59.81,43.5 58.81,42.5 57.81,42.5 IC3.7
N$35  (via drill 0.25)
  Top 0.152: v42.81,39 34.81,31 34.81,28 34.31,28 31.81,25.5 30.81,25.5 29.81,26.5 R35.2
  Bottom 0.152: v42.81,39 45.81,39 U1.3
N$36
  Top 0.152: CSN.TP 82.81,40 81.31,38.5 81.31,37 73.81,37 72.81,36 46.31,36 45.81,36.5 44.31,36.5 39.81,32 U$3.CSN
N$37  (via drill 0.25)
  Top 0.152: v8.31,29.5 6.31,29.5 5.81,29 4.81,29 S2.1
  Bottom 0.152: v8.31,29.5 8.31,28 R18.2 | R26.1 2.31,40.5 2.31,30.5 4.31,28.5 S2.1
ONBOARD  (via drill 0.25)
  Top 0.152: v43.81,52.5 44.81,51.5 84.31,51.5 | v87.31,51.5 84.31,51.5 | v70.81,27 75.31,31.5 79.31,31.5 85.31,37.5 85.31,41 86.31,42 86.31,44 85.31,44 84.31,45 84.31,51.5
  Bottom 0.152: AM2320.2 54.31,16.5 54.31,14 R28.2 54.81,13.5 55.81,12.5 58.31,12.5 70.81,25 v70.81,27 | v43.81,52.5 39.31,52.5 IC1.4 | v87.31,51.5 88.31,51.5 90.31,53.5 90.31,56 92.31,58 U$1.7
S+
  Bottom 0.152: 38.81,26 41.31,28.5 41.31,32 38.31,35 38.31,37 U2.2 | J1.GND 11.81,8.5 17.81,2.5 19.81,2.5 U$7.IN+.2 20.31,2.5 28.31,2.5 36.31,10.5 36.31,15.5 39.81,19 39.81,21.5 38.81,22.5 38.81,26 | 38.81,26 R32.2
SCK  (via drill 0.25)
  Top 0.152: SCK.TP 86.81,40.5 86.81,41.5 87.81,42.5 U$1.16 | v42.81,22.5 46.31,22.5 47.81,21 55.31,21 57.31,23 80.81,23 v85.31,27.5
  Bottom 0.152: 93.81,36 87.31,42.5 U$1.16 | v42.81,22.5 39.81,25.5 39.81,26.5 42.31,29 U$3.SCK | 93.81,36 v85.31,27.5 | 93.81,36 U$8.5
SCL  (via drill 0.25)
  Top 0.152: v16.81,24 20.31,20.5 U$5.SCL | v26.31,44 38.81,44 v43.81,49 45.81,51 50.81,51 54.31,47.5 56.81,47.5 v59.81,44.5 | v98.31,37 99.31,38 SCL.TP | U$1.A5 98.81,45.5 97.31,44 96.81,44 96.31,43.5 96.31,40.5 97.31,39.5 97.31,36 96.81,36 U$8.4
  Bottom 0.152: 24.81,45.5 16.31,37 16.31,33.5 15.31,32.5 15.31,25.5 v16.81,24 | 24.81,45.5 25.31,46 25.31,47 IC2.14 | v43.81,49 46.31,51.5 48.31,51.5 IC1.14 | 24.81,45.5 v26.31,44 | R3.1 101.31,50.5 101.31,48.5 98.81,46 U$1.A5 | v98.31,37 96.81,35.5 U$8.4 96.31,35.5 84.81,24 | 84.81,24 88.81,20 88.81,13 U$10.SCL 89.31,13 91.31,11 100.81,11 102.31,12.5 102.81,12.5 U$11.SCL | 84.81,24 72.81,36 71.81,36 70.31,37.5 67.31,37.5 IC3.14 66.81,37.5 65.81,37.5 65.31,38 65.31,39 v59.81,44.5
SDA  (via drill 0.25)
  Top 0.152: v16.81,25 16.31,24.5 16.31,21.5 16.81,21.5 17.81,20.5 U$5.SDA | SDA.TP 99.31,40 97.81,38.5 97.81,36 98.81,36 U$8.3 | 50.81,50 53.81,47 55.31,47 v60.81,41.5 | 50.81,50 v50.31,50.5 | 91.81,11 87.81,11 86.31,12.5 U$10.SDA | 91.81,11 98.81,11 100.31,12.5 U$11.SDA | 91.81,11 v91.81,11.5 | v28.81,43.5 44.31,43.5 50.81,50
  Bottom 0.152: 26.81,43.5 26.81,47 IC2.15 | 26.81,43.5 22.31,39 22.31,34.5 16.81,29 v16.81,25 | R4.1 98.81,50.5 98.81,47.5 96.81,45.5 U$1.A4 96.31,45.5 96.31,42 98.81,39.5 98.81,36 U$8.3 98.81,35.5 98.81,18.5 v91.81,11.5 | U$10.SDA 86.81,13 85.81,14 85.81,19 68.81,36 67.31,36 IC3.15 66.81,36 66.31,36 v60.81,41.5 | v50.31,50.5 49.81,50 48.81,50 IC1.15 | v28.81,43.5 26.81,43.5
(copper drawn outside any net)
  shapes: Top area x2

### Text on the board
tNames: ON | 1 | 2 | 3 | 4 | Hive Monitor | Enable LED | www.akouw.com | REV A | 3.3v Reg | 5v Reg | Battery | S | + | - | CT
bNames: I2C | www.akouw.com